# Altium project Ultrascale.PrjPcb (part 6 of 9)

## Sheet PMOD_ARD_RASP.SchDoc
size A3
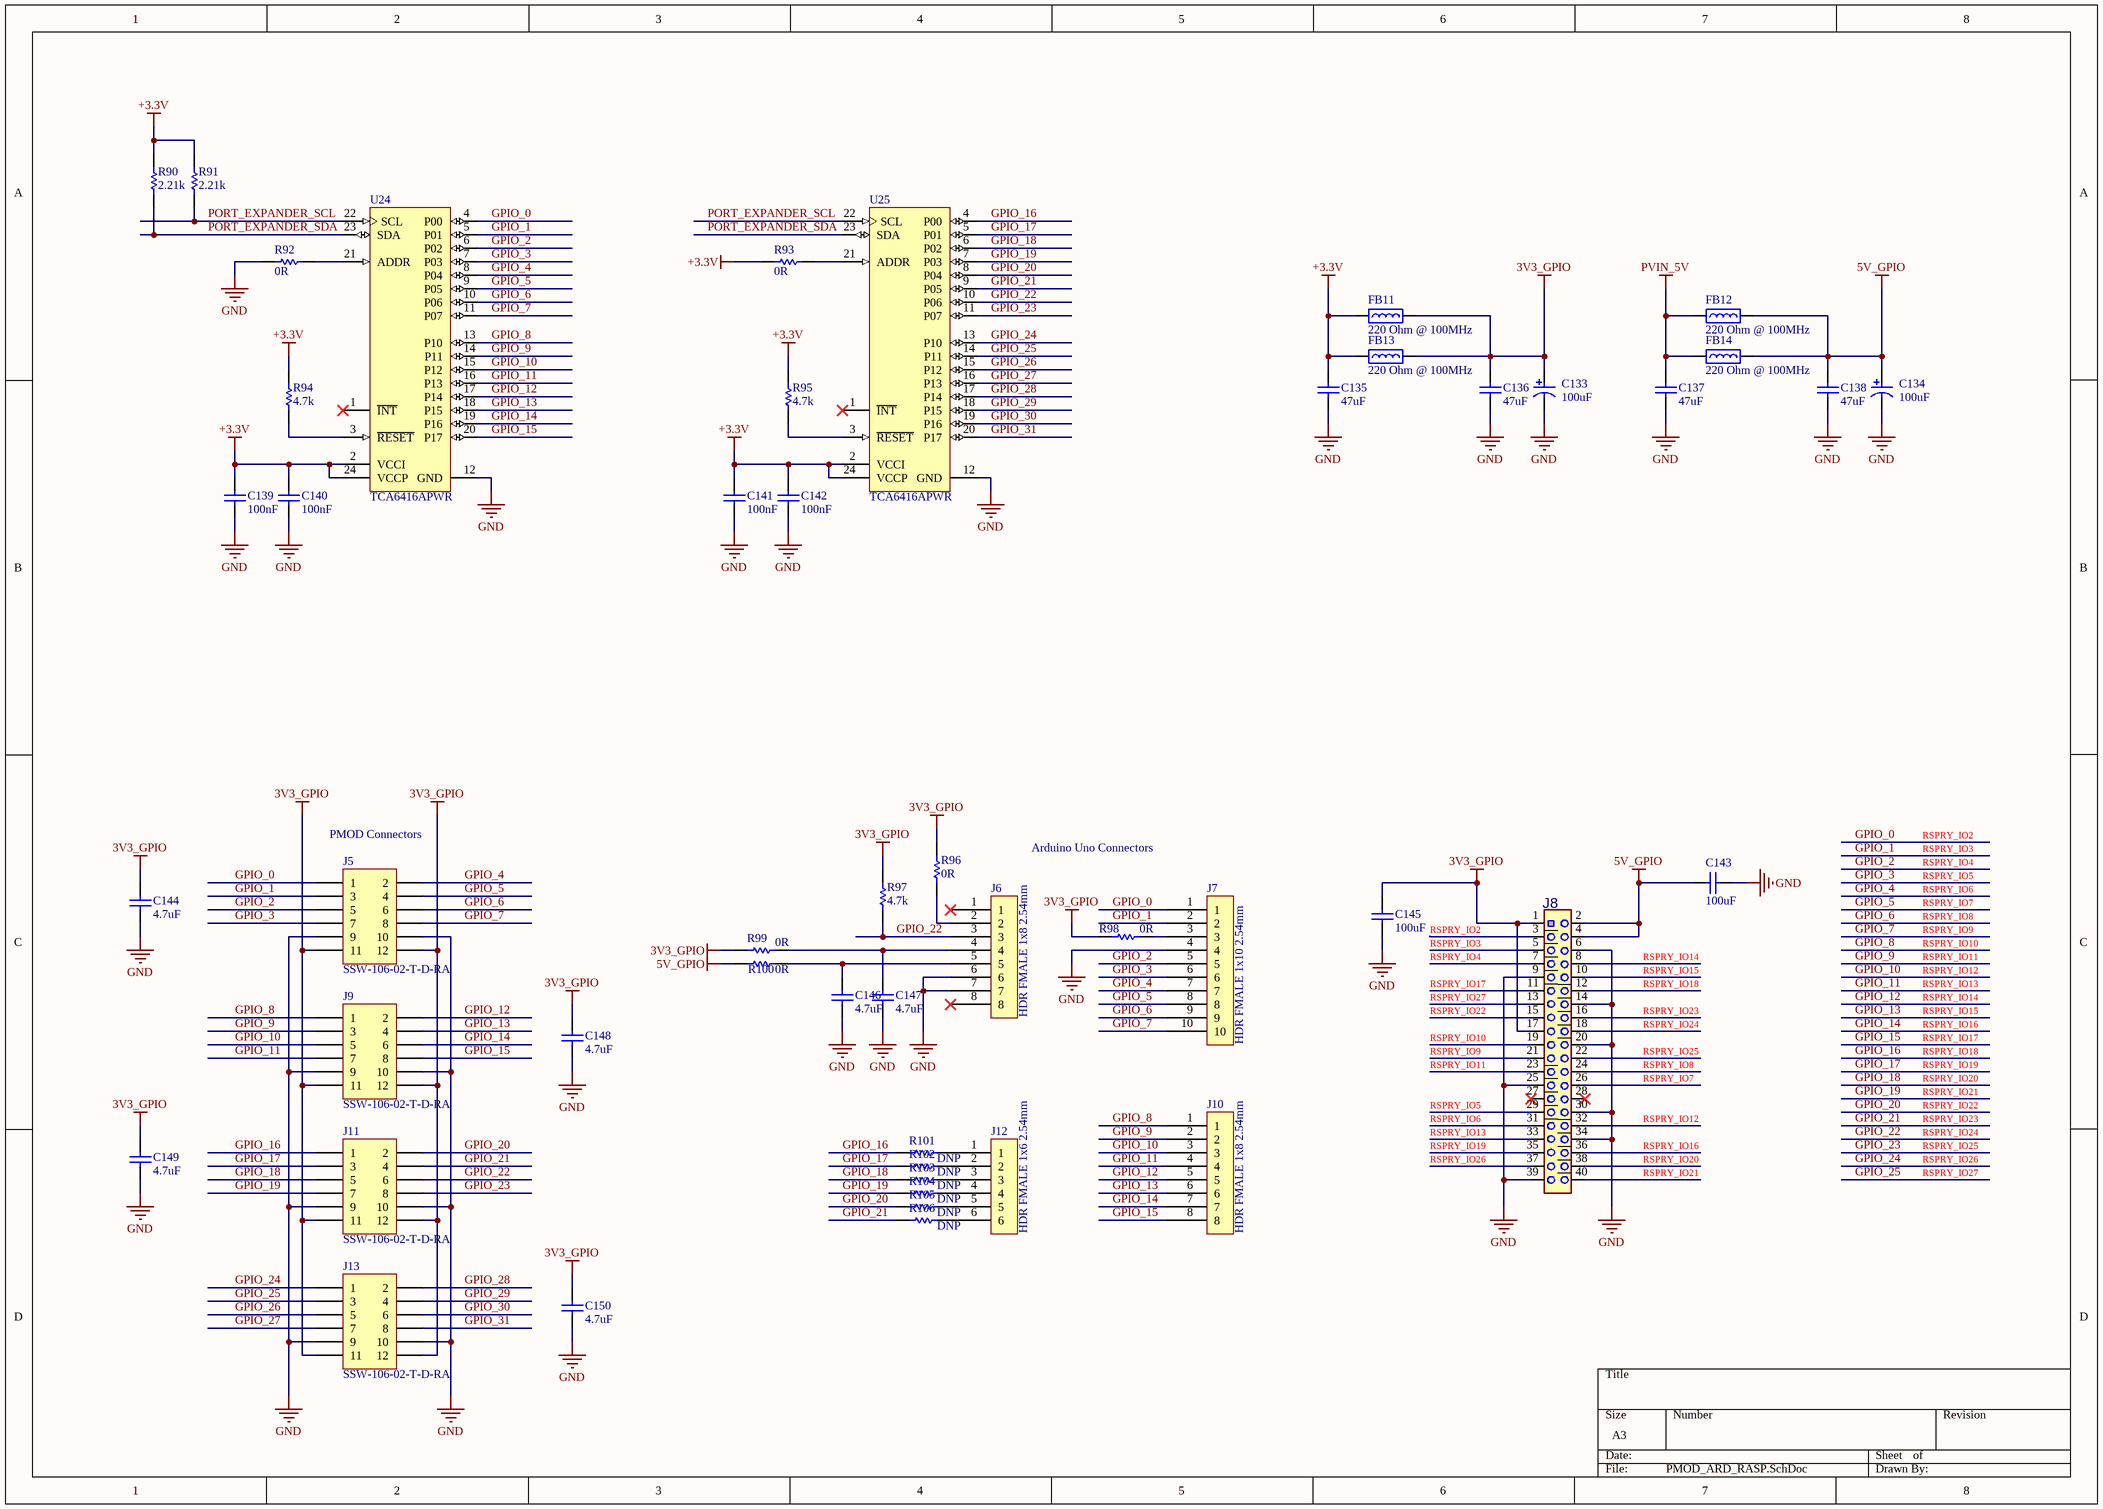
[diagram p18: PMOD_ARD_RASP.SchDoc]

### Parts
C133  100uF  [AVX_TAN_F95_P_0905]
C134  100uF  [AVX_TAN_F95_P_0905]
C135  47uF  [CAPC3216L_1206]
C136  47uF  [CAPC3216L_1206]
C137  47uF  [CAPC3216L_1206]
C138  47uF  [CAPC3216L_1206]
C139  100nF  [CAPC1005L_0402]
C140  100nF  [CAPC1005L_0402]
C141  100nF  [CAPC1005L_0402]
C142  100nF  [CAPC1005L_0402]
C143  100uF  [CAPC3225N_1210]
C144  4.7uF  [CAPC1005L_0402]
C145  100uF  [CAPC3225N_1210]
C146  4.7uF  [CAPC1005L_0402]
C147  4.7uF  [CAPC1005L_0402]
C148  4.7uF  [CAPC1005L_0402]
C149  4.7uF  [CAPC1005L_0402]
C150  4.7uF  [CAPC1005L_0402]
FB11  Impedance @ Frequency: 220 Ohm @ 100MHz  [INDC1608N_0603]  (hidden comment: BEAD0603_220_2A5_40M)
FB12  Impedance @ Frequency: 220 Ohm @ 100MHz  [INDC1608N_0603]  (hidden comment: BEAD0603_220_2A5_40M)
FB13  Impedance @ Frequency: 220 Ohm @ 100MHz  [INDC1608N_0603]  (hidden comment: BEAD0603_220_2A5_40M)
FB14  Impedance @ Frequency: 220 Ohm @ 100MHz  [INDC1608N_0603]  (hidden comment: BEAD0603_220_2A5_40M)
J5  SSW-106-02-T-D-RA  [HDR2X6H]
J6  HDR FMALE 1x8 2.54mm  [Hdr_Female_1x8_2.54mm]
J7  HDR FMALE 1x10 2.54mm  [Hdr_Female_1x10_2.54mm]
J8  Header 2x20  [HDR_M_2.54_2x20]  (value not drawn)
J9  SSW-106-02-T-D-RA  [HDR2X6H]
J10  HDR FMALE 1x8 2.54mm  [Hdr_Female_1x8_2.54mm]
J11  SSW-106-02-T-D-RA  [HDR2X6H]
J12  HDR FMALE 1x6 2.54mm  [Hdr_Female_1x6_2.54mm]
J13  SSW-106-02-T-D-RA  [HDR2X6H]
R90  value 2.21k  [RESC1005L_0402]  (hidden comment: RES0402_2K21_0W1_1T)
R91  value 2.21k  [RESC1005L_0402]  (hidden comment: RES0402_2K21_0W1_1T)
R92  value 0R  [RESC1005L_0402]  (hidden comment: RES0402_0R_0W1)
R93  value 0R  [RESC1005L_0402]  (hidden comment: RES0402_0R_0W1)
R94  value 4.7k  [RESC1005L_0402]  (hidden comment: RES0402_4K7_0W1_1T)
R95  value 4.7k  [RESC1005L_0402]  (hidden comment: RES0402_4K7_0W1_1T)
R96  value 0R  [RESC1005L_0402]  (hidden comment: RES0402_0R)
R97  value 4.7k  [RESC1005L_0402]  (hidden comment: RES0402_4K7_0W1_1T)
R98  value 0R  [RESC1005L_0402]  (hidden comment: RES0402_0R)
R99  value 0R  [RESC1005L_0402]  (hidden comment: RES0402_0R)
R100  value 0R  [RESC1005L_0402]  (hidden comment: RES0402_0R)
R101  value DNP  [RESC1005L_0402]  (hidden comment: RES0402)
R102  value DNP  [RESC1005L_0402]  (hidden comment: RES0402)
R103  value DNP  [RESC1005L_0402]  (hidden comment: RES0402)
R104  value DNP  [RESC1005L_0402]  (hidden comment: RES0402)
R105  value DNP  [RESC1005L_0402]  (hidden comment: RES0402)
R106  value DNP  [RESC1005L_0402]  (hidden comment: RES0402)
U24  TCA6416APWR  [PW24_L]
U25  TCA6416APWR  [PW24_L]

### Nets
3V3_GPIO: C133.1 C136.2 C144.2 C145.2 C148.2 C149.2 C150.2 FB11.2 FB13.2 J5.11 J5.12 J8.1(P1) J8.17(P17) J9.11 J9.12 J11.11 J11.12 J13.11 J13.12 R96.1 R97.2 R98.2 R99.2
5V_GPIO: C134.1 C138.2 C143.2 FB12.2 FB14.2 J8.2(P2) J8.4(P4) R100.2
+3.3V: C135.2 C139.2 C140.2 C141.2 C142.2 FB11.1 FB13.1 R90.2 R91.2 R93.1 R94.2 R95.2 U24.2(VCCI) U24.24(VCCP) U25.2(VCCI) U25.24(VCCP)
GND: C133.2 C134.2 C135.1 C136.1 C137.1 C138.1 C139.1 C140.1 C141.1 C142.1 C143.1 C144.1 C145.1 C146.1 C147.1 C148.1 C149.1 C150.1 J5.9 J5.10 J6.6 J6.7 J7.4 J8.6(P6) J8.9(P9) J8.14(P14) J8.20(P20) J8.25(P25) J8.30(P30) J8.34(P34) J8.39(P39) J9.9 J9.10 J11.9 J11.10 J13.9 J13.10 R92.1 U24.12(GND) U25.12(GND)
PVIN_5V: C137.2 FB12.1 FB14.1
GPIO_0: J5.1 J7.1 J8.3(P3) U24.4(P00)  [also labelled RSPRY_IO2]
GPIO_1: J5.3 J7.2 J8.5(P5) U24.5(P01)  [also labelled RSPRY_IO3]
GPIO_2: J5.5 J7.5 J8.7(P7) U24.6(P02)  [also labelled RSPRY_IO4]
GPIO_3: J5.7 J7.6 J8.29(P29) U24.7(P03)  [also labelled RSPRY_IO5]
GPIO_4: J5.2 J7.7 J8.31(P31) U24.8(P04)  [also labelled RSPRY_IO6]
GPIO_5: J5.4 J7.8 J8.26(P26) U24.9(P05)  [also labelled RSPRY_IO7]
GPIO_6: J5.6 J7.9 J8.24(P24) U24.10(P06)  [also labelled RSPRY_IO8]
GPIO_7: J5.8 J7.10 J8.21(P21) U24.11(P07)  [also labelled RSPRY_IO9]
GPIO_8: J8.19(P19) J9.1 J10.1 U24.13(P10)  [also labelled RSPRY_IO10]
GPIO_9: J8.23(P23) J9.3 J10.2 U24.14(P11)  [also labelled RSPRY_IO11]
GPIO_10: J8.32(P32) J9.5 J10.3 U24.15(P12)  [also labelled RSPRY_IO12]
GPIO_11: J8.33(P33) J9.7 J10.4 U24.16(P13)  [also labelled RSPRY_IO13]
GPIO_12: J8.8(P8) J9.2 J10.5 U24.17(P14)  [also labelled RSPRY_IO14]
GPIO_13: J8.10(P10) J9.4 J10.6 U24.18(P15)  [also labelled RSPRY_IO15]
GPIO_14: J8.36(P36) J9.6 J10.7 U24.19(P16)  [also labelled RSPRY_IO16]
GPIO_15: J8.11(P11) J9.8 J10.8 U24.20(P17)  [also labelled RSPRY_IO17]
GPIO_16: J8.12(P12) J11.1 R101.1 U25.4(P00)  [also labelled RSPRY_IO18]
GPIO_17: J8.35(P35) J11.3 R102.1 U25.5(P01)  [also labelled RSPRY_IO19]
GPIO_18: J8.38(P38) J11.5 R103.1 U25.6(P02)  [also labelled RSPRY_IO20]
GPIO_19: J8.40(P40) J11.7 R104.1 U25.7(P03)  [also labelled RSPRY_IO21]
GPIO_20: J8.15(P15) J11.2 R105.1 U25.8(P04)  [also labelled RSPRY_IO22]
GPIO_21: J8.16(P16) J11.4 R106.1 U25.9(P05)  [also labelled RSPRY_IO23]
GPIO_22: J6.3 J8.18(P18) J11.6 R97.1 U25.10(P06)  [also labelled RSPRY_IO24]
GPIO_23: J8.22(P22) J11.8 U25.11(P07)  [also labelled RSPRY_IO25]
GPIO_24: J8.37(P37) J13.1 U25.13(P10)  [also labelled RSPRY_IO26]
GPIO_25: J8.13(P13) J13.3 U25.14(P11)  [also labelled RSPRY_IO27]
GPIO_26: J13.5 U25.15(P12)
GPIO_27: J13.7 U25.16(P13)
GPIO_28: J13.2 U25.17(P14)
GPIO_29: J13.4 U25.18(P15)
GPIO_30: J13.6 U25.19(P16)
GPIO_31: J13.8 U25.20(P17)
PORT_EXPANDER_SCL: R91.1 U24.22(SCL) U25.22(SCL)
PORT_EXPANDER_SDA: R90.1 U24.23(SDA) U25.23(SDA)
NetC146_2: C146.2 J6.5 R100.1
NetC147_2: C147.2 J6.4 R99.1
NetJ6_2: J6.2 R96.2
NetJ7_3: J7.3 R98.1
NetJ12_1: J12.1 R101.2
NetJ12_2: J12.2 R102.2
NetJ12_3: J12.3 R103.2
NetJ12_4: J12.4 R104.2
NetJ12_5: J12.5 R105.2
NetJ12_6: J12.6 R106.2
NetR92_2: R92.2 U24.21(ADDR)
NetR93_2: R93.2 U25.21(ADDR)
NetR94_1: R94.1 U24.3(~{RESET})
NetR95_1: R95.1 U25.3(~{RESET})

Not connected (* = marked no-connect by the designer): J6 1* 8*; J8 27(P27)* 28(P28)*; U24 1(~{INT})*; U25 1(~{INT})*

### Notes on the sheet
- (near J5) PMOD Connectors
- Arduino Uno Connectors

### Library data of the parts
C133 C134 = CAPELE0905TAN100U6V3_20T: as C123 on sheet USB3.0_UART; Package: 0905 P; ComponentLink1Description: Datasheet; ComponentLink1URL: C:\Users\Public\Documents\Altium\AD16\Library\PDF\F95.pdf; Value: 100uF; Voltage: 6.3V; Tolerance: 20%; Supplier 1: Digi-Key; Supplier Part Number 1: 478-8393-1-ND; Operating Temperature: -55°C ~ 125°C
C135-C138 = CAPCER1206X5R47U25V_20T: CAP CER 47UF 25V X5R 1206; Manufacturer 1: TDK Corporation; Manufacturer Part Number 1: C3216X5R1E476M160AC; Tolerance: 20%; Package: 1206; ComponentLink1Description: Datasheet; Value: 47uF; Voltage: 25V; Temperature Coefficient: X5R; Supplier 1: Digi-Key; Supplier Part Number 1: 445-8047-1-ND; Operating Temperature: -55°C ~ 85°C
C139-C142 = CAPCER0402X7R100N25V_10T: as C426-C429 on sheet PS_GTR; Package: 0402; ComponentLink1Description: Datasheet; Value: 100nF; Voltage: 25V; Temperature Coefficient: X7R; Supplier 1: Digi-Key; Supplier Part Number 1: 490-10698-1-ND; Operating Temperature: -55°C ~ 125°C
C143 C145 = CAPCER1210X5R100U16V_20T: CAP CER 100UF 16V X5R 1210; Manufacturer 1: Taiyo Yuden; Manufacturer Part Number 1: EMK325ABJ107MM-T; Tolerance: 20%; Package: 1210; ComponentLink1Description: Datasheet; Value: 100uF; Voltage: 16V; Temperature Coefficient: X5R; Supplier 1: Digi-Key; Supplier Part Number 1: 587-3152-1-ND; Operating Temperature: -55°C ~ 85°C
C144 C146-C150 = CAPCER0402X5R4U710V_10T: as C127 on sheet USB3.0_UART; Package: 0402; ComponentLink1Description: Datasheet; Value: 4.7uF; Voltage: 10V; Temperature Coefficient: x5R; Supplier 1: Digi-Key; Supplier Part Number 1: 445-13820-1-ND; Operating Temperature: -55°C ~ 85°C
FB11-FB14 = BEAD0603_220_2A5_40M: as FB42 on sheet PS_GTR; Package: 0603; ComponentLink1Description: Datasheet; ComponentLink1URL: C:\Users\Public\Documents\Altium\AD16\Library\PDF\ENFA0003.pdf; Supplier 1: Digi-Key; Supplier Part Number 1: 490-5225-1-ND; Operating Temperature: -55°C ~ 125°C
J5 J9 J11 J13 = SSW-106-02-T-D-RA: CONN RCPT .100" 12PS DL R/A TIN; Manufacturer 1: Samtec Inc.; ComponentLink1Description: Datasheet; ComponentLink1URL: C:\Users\Public\Documents\Altium\AD16\Library\PDF\ssw-1xx-xx-xxx-x-xx-xxx-xx-mkt.pdf; Supplier 1: Digi-Key; Supplier Part Number 1: SAM10026-ND; Manufacturer Part Number 1: SSW-106-02-T-D-RA; Operating Temperature: -55°C ~ 105°C; Insulation Height: 0.195" (4.95mm)
J6 J10 = M20-7820842: 08-WAY SIL VERT SOCKET L/FREE; Manufacturer 1: Harwin Inc; Connector Type: Receptacle; Number of Positions: 8; Number of Positions Loaded: All; Pitch: 0.100" (2.54mm); .Creator: MM; .Checked PCB: RF; Supplier 1: Digi-Key; Manufacturer Part Number 1: M20-7820842; RoHS: RoHS Compliant; Category: Connectors, Interconnects; Stock 1: 2070; Pricing 1: 1=1.1, 29=0.91207, 58=0.87397, 116=0.83603, 261=0.76, 522=0.684, 1015=0.608, 2523=0.551 (USD); Packaging: Tube; Contact Type: Female Socket; Number of Rows: 1; Row Spacing: -; Mounting Type: Through Hole; Termination: Solder; Fastening Type: -; Features: -; Contact Finish: Gold; Contact Finish Thickness: Flash; Color: Black; ComponentLink1URL: http://harwin.com/includes/pdfs/M20-782.pdf; ComponentLink1Description: http://harwin.com/includes/pdfs/M20-782.pdf; Supplier Part Number 1: 952-1823-ND; .Checked SCH: RF
J7 = M20-7821046: 10-WAY SIL VERT SOCKET L/FREE; Manufacturer 1: Harwin Inc; Connector Type: Receptacle; Number of Positions: 10; Number of Positions Loaded: All; Pitch: 0.100" (2.54mm); .Creator: MM; .Checked PCB: RF; Supplier 1: Digi-Key; Manufacturer Part Number 1: M20-7821046; RoHS: RoHS Compliant; Category: Connectors, Interconnects; Stock 1: 214; Pricing 1: 1=1.28, 23=1.12217, 46=1.05609, 69=1.01203, 115=0.968, 253=0.88, 506=0.792, 1012=0.704, 2507=0.638 (USD); Packaging: Tube; Contact Type: Female Socket; Number of Rows: 1; Row Spacing: -; Mounting Type: Through Hole; Termination: Solder; Fastening Type: -; Features: -; Contact Finish: Tin; Contact Finish Thickness: -; Color: Black; ComponentLink1URL: http://harwin.com/includes/pdfs/M20-782.pdf; ComponentLink1Description: http://harwin.com/includes/pdfs/M20-782.pdf; Supplier Part Number 1: 952-1847-ND; .Checked SCH: RF
J8 = Header 2x20: CONN HEADER 40POS .100" SGL GOLD
J12 = M20-7820646: 06-WAY SIL VERT SOCKET L/FREE; Manufacturer 1: Harwin Inc; Connector Type: Receptacle; Number of Positions: 6; Number of Positions Loaded: All; Pitch: 0.100" (2.54mm); .Checked PCB: MM; Supplier 1: Digi-Key; Manufacturer Part Number 1: M20-7820646; RoHS: RoHS Compliant; Category: Connectors, Interconnects; Stock 1: 87; Pricing 1: 1=0.96, 38=0.79211, 76=0.75895, 114=0.72596, 266=0.66, 532=0.594, 1026=0.528, 2508=0.4785 (USD); Packaging: Tube; Contact Type: Female Socket; Number of Rows: 1; Row Spacing: -; Mounting Type: Through Hole; Termination: Solder; Fastening Type: -; Features: -; Contact Finish: Tin; Contact Finish Thickness: -; Color: Black; ComponentLink1URL: http://harwin.com/includes/pdfs/M20-782.pdf; ComponentLink1Description: http://harwin.com/includes/pdfs/M20-782.pdf; Supplier Part Number 1: 952-1809-ND; .Checked SCH: MM; .Creator: MM
R90 R91 = RES0402_2K21_0W1_1T: RES SMD 2.21K OHM 1% 1/10W 0402; Manufacturer 1: Panasonic Electronic Components; Manufacturer Part Number 1: ERJ-2RKF2211X; Package: 0402; ComponentLink1Description: Datasheet; Power: 1/10W; Tolerance: 1%; Supplier 1: Digi-Key; Supplier Part Number 1: P2.21KLCT-ND
R92 R93 = RES0402_0R_0W1: as R305 on sheet PS_GTR; Package: 0402; ComponentLink1Description: Datasheet; Power: 1/10W; Tolerance: -; Supplier 1: Digi-Key; Supplier Part Number 1: P0.0JCT-ND
R94 R95 R97 = RES0402_4K7_0W1_1T: as R80 on sheet USB3.0_UART; Package: 0402; ComponentLink1Description: Datasheet; Power: 1/10W; Tolerance: 1%; Supplier 1: Digi-Key; Supplier Part Number 1: P4.70KLCT-ND
R96 R98-R100 = RES0402_0R: as R198 on sheet DisplayPort; Package: 0402; ComponentLink1Description: Datasheet; Tolerance: -; Supplier 1: Digi-Key; Supplier Part Number 1: 541-0.0JCT-ND
R101-R106 = RES0402: RES SMD 0402 Footprint; Package: 0402; ComponentLink1Description: Datasheet; Tolerance: -
U24 U25 = TCA6416APWR: Low-Voltage 16-Bit I2C and SMBus I/O Expander, 16 Outputs, 1.65 to 5.5 V, -40 to 85 degC, 24-pin TSSOP (PW), Green (RoHS & no Sb/Br); Manufacturer: Texas Instruments; SubFamily: I2C IO Expander; No. of Outputs: 16; Interrupt Output: Yes; fSCLK(Max)(MHz): 400; VCC(Min)(V): 1.65; VCC(Max)(V): 5.5; I2C Address: 0100 00x; DatasheetVersion: SCPS194A; PackageVersion: revG, Feb-2011; PackageReference: PW24; PackageDescription: 24-Pin Thin Small Outline Package 0.65 mm Pitch; Supplier 1: Arrow; Supplier Part Number 1: 47581856S8237284N7713; Supplier 2: Digi-Key; Supplier Part Number 2: 296-24536-2-ND; Supplier 3: Digi-Key; Supplier Part Number 3: 296-24536-1-ND; Supplier 4: Digi-Key; Supplier Part Number 4: 296-24536-6-ND; Supplier 5: Farnell; Supplier Part Number 5: 2101304; Supplier 6: Newark; Supplier Part Number 6: 10R6151; Supplier 7: Mouser; Supplier Part Number 7: 595-TCA6416APWR; Eco-Plan: Green (RoHS & no Sb/Br); Reset Input: Yes; Max Frequency(kHz): 400; # of I/Os: 16; Vcc range(V): 1.65 to 5.5; Low Power: Yes; Configuration Registers: Yes; 5V Tolerant I/O: Yes; Push-Pull I/O Type: Yes; Mounting Technology: Surface Mount; PartNumber: TCA6416APWR; Code_JEDEC: MO-153; ComponentLink1Description: Datasheet; ComponentLink1URL: http://www.ti.com/general/docs/lit/getliterature.tsp?genericPartNumber=TCA6416A&fileType=pdf; ComponentLink2Description: Package Specification; ComponentLink2URL: http://www.ti.com/litv/pdf/mpds177g

## Sheet eMMC_TPM.SchDoc
size A3
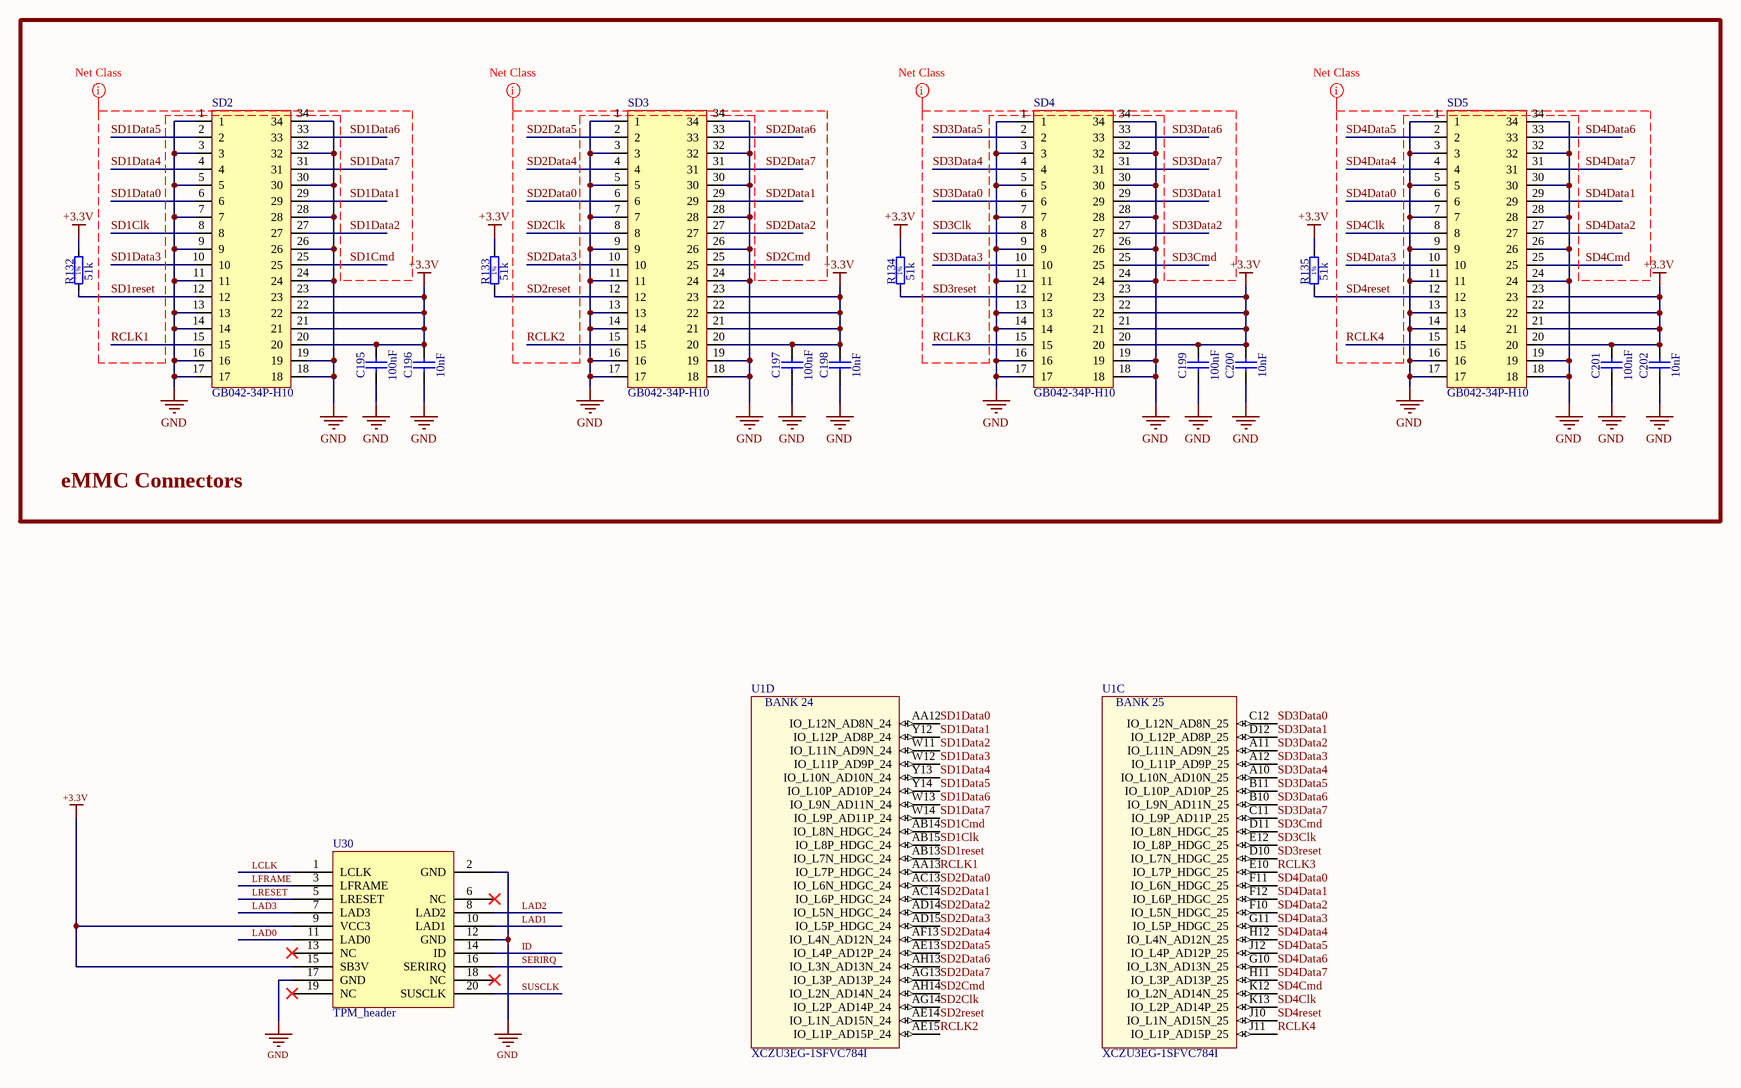
[diagram p19: eMMC_TPM.SchDoc]

### Parts
C195  100nF  [CAPC1608X87N]
C196  10nF  [CAPC1608X87N]
C197  100nF  [CAPC1608X87N]
C198  10nF  [CAPC1608X87N]
C199  100nF  [CAPC1608X87N]
C200  10nF  [CAPC1608X87N]
C201  100nF  [CAPC1608X87N]
C202  10nF  [CAPC1608X87N]
R132  51k  [RESC1608X55N]
R133  51k  [RESC1608X55N]
R134  51k  [RESC1608X55N]
R135  51k  [RESC1608X55N]
SD2  GB042-34P-H10  [GB042-34P-H10]
SD3  GB042-34P-H10  [GB042-34P-H10]
SD4  GB042-34P-H10  [GB042-34P-H10]
SD5  GB042-34P-H10  [GB042-34P-H10]
U1  XCZU3EG-1SFVC784I  [BGA784x28]  (parts C,D of 22)
U30  TPM_header  [PIN HEADER 20POS]

### Blocks framed on the sheet
eMMC Connectors: C195-C202 R132-R135 SD2-SD5

### Nets
+3.3V: C195.2 C196.2 C197.2 C198.2 C199.2 C200.2 C201.2 C202.2 R132.2 R133.2 R134.2 R135.2 SD2.20 SD2.21 SD2.22 SD2.23 SD3.20 SD3.21 SD3.22 SD3.23 SD4.20 SD4.21 SD4.22 SD4.23 SD5.20 SD5.21 SD5.22 SD5.23 U30.9(VCC3) U30.15(SB3V)
GND: C195.1 C196.1 C197.1 C198.1 C199.1 C200.1 C201.1 C202.1 SD2.1 SD2.3 SD2.5 SD2.7 SD2.9 SD2.11 SD2.13 SD2.14 SD2.16 SD2.17 SD2.18 SD2.19 SD2.24 SD2.26 SD2.28 SD2.30 SD2.32 SD2.34 SD3.1 SD3.3 SD3.5 SD3.7 SD3.9 SD3.11 SD3.13 SD3.14 SD3.16 SD3.17 SD3.18 SD3.19 SD3.24 SD3.26 SD3.28 SD3.30 SD3.32 SD3.34 SD4.1 SD4.3 SD4.5 SD4.7 SD4.9 SD4.11 SD4.13 SD4.14 SD4.16 SD4.17 SD4.18 SD4.19 SD4.24 SD4.26 SD4.28 SD4.30 SD4.32 SD4.34 SD5.1 SD5.3 SD5.5 SD5.7 SD5.9 SD5.11 SD5.13 SD5.14 SD5.16 SD5.17 SD5.18 SD5.19 SD5.24 SD5.26 SD5.28 SD5.30 SD5.32 SD5.34 U30.2(GND) U30.12(GND) U30.17(GND)
ID: U30.14(ID)
LAD0: U30.11(LAD0)
LAD1: U30.10(LAD1)
LAD2: U30.8(LAD2)
LAD3: U30.7(LAD3)
LCLK: U30.1(LCLK)
LFRAME: U30.3(LFRAME)
LRESET: U30.5(LRESET)
RCLK1: SD2.15 U1.AA13(IO_L7P_HDGC_24)
RCLK2: SD3.15 U1.AE15(IO_L1P_AD15P_24)
RCLK3: SD4.15 U1.E10(IO_L7P_HDGC_25)
RCLK4: SD5.15 U1.J11(IO_L1P_AD15P_25)
SD1Clk: SD2.8 U1.AB15(IO_L8P_HDGC_24)
SD1Cmd: SD2.25 U1.AB14(IO_L8N_HDGC_24)
SD1Data0: SD2.6 U1.AA12(IO_L12N_AD8N_24)
SD1Data1: SD2.29 U1.Y12(IO_L12P_AD8P_24)
SD1Data2: SD2.27 U1.W11(IO_L11N_AD9N_24)
SD1Data3: SD2.10 U1.W12(IO_L11P_AD9P_24)
SD1Data4: SD2.4 U1.Y13(IO_L10N_AD10N_24)
SD1Data5: SD2.2 U1.Y14(IO_L10P_AD10P_24)
SD1Data6: SD2.33 U1.W13(IO_L9N_AD11N_24)
SD1Data7: SD2.31 U1.W14(IO_L9P_AD11P_24)
SD1reset: R132.1 SD2.12 U1.AB13(IO_L7N_HDGC_24)
SD2Clk: SD3.8 U1.AG14(IO_L2P_AD14P_24)
SD2Cmd: SD3.25 U1.AH14(IO_L2N_AD14N_24)
SD2Data0: SD3.6 U1.AC13(IO_L6N_HDGC_24)
SD2Data1: SD3.29 U1.AC14(IO_L6P_HDGC_24)
SD2Data2: SD3.27 U1.AD14(IO_L5N_HDGC_24)
SD2Data3: SD3.10 U1.AD15(IO_L5P_HDGC_24)
SD2Data4: SD3.4 U1.AF13(IO_L4N_AD12N_24)
SD2Data5: SD3.2 U1.AE13(IO_L4P_AD12P_24)
SD2Data6: SD3.33 U1.AH13(IO_L3N_AD13N_24)
SD2Data7: SD3.31 U1.AG13(IO_L3P_AD13P_24)
SD2reset: R133.1 SD3.12 U1.AE14(IO_L1N_AD15N_24)
SD3Clk: SD4.8 U1.E12(IO_L8P_HDGC_25)
SD3Cmd: SD4.25 U1.D11(IO_L8N_HDGC_25)
SD3Data0: SD4.6 U1.C12(IO_L12N_AD8N_25)
SD3Data1: SD4.29 U1.D12(IO_L12P_AD8P_25)
SD3Data2: SD4.27 U1.A11(IO_L11N_AD9N_25)
SD3Data3: SD4.10 U1.A12(IO_L11P_AD9P_25)
SD3Data4: SD4.4 U1.A10(IO_L10N_AD10N_25)
SD3Data5: SD4.2 U1.B11(IO_L10P_AD10P_25)
SD3Data6: SD4.33 U1.B10(IO_L9N_AD11N_25)
SD3Data7: SD4.31 U1.C11(IO_L9P_AD11P_25)
SD3reset: R134.1 SD4.12 U1.D10(IO_L7N_HDGC_25)
SD4Clk: SD5.8 U1.K13(IO_L2P_AD14P_25)
SD4Cmd: SD5.25 U1.K12(IO_L2N_AD14N_25)
SD4Data0: SD5.6 U1.F11(IO_L6N_HDGC_25)
SD4Data1: SD5.29 U1.F12(IO_L6P_HDGC_25)
SD4Data2: SD5.27 U1.F10(IO_L5N_HDGC_25)
SD4Data3: SD5.10 U1.G11(IO_L5P_HDGC_25)
SD4Data4: SD5.4 U1.H12(IO_L4N_AD12N_25)
SD4Data5: SD5.2 U1.J12(IO_L4P_AD12P_25)
SD4Data6: SD5.33 U1.G10(IO_L3N_AD13N_25)
SD4Data7: SD5.31 U1.H11(IO_L3P_AD13P_25)
SD4reset: R135.1 SD5.12 U1.J10(IO_L1N_AD15N_25)
SERIRQ: U30.16(SERIRQ)
SUSCLK: U30.20(SUSCLK)

Not connected (* = marked no-connect by the designer): U30 6(NC)* 13(NC)* 18(NC)* 19(NC)*

### Layout directives
net class SD1: RCLK1, SD1Clk, SD1Cmd, SD1Data0, SD1Data1, SD1Data2, SD1Data3, SD1Data4, SD1Data5, SD1Data6, SD1Data7, SD1reset
net class SD2: RCLK2, SD2Clk, SD2Cmd, SD2Data0, SD2Data1, SD2Data2, SD2Data3, SD2Data4, SD2Data5, SD2Data6, SD2Data7, SD2reset
net class SD3: RCLK3, SD3Clk, SD3Cmd, SD3Data0, SD3Data1, SD3Data2, SD3Data3, SD3Data4, SD3Data5, SD3Data6, SD3Data7, SD3reset
net class SD4: RCLK4, SD4Clk, SD4Cmd, SD4Data0, SD4Data1, SD4Data2, SD4Data3, SD4Data4, SD4Data5, SD4Data6, SD4Data7, SD4reset

### Notes on the sheet
- (in symbol R0603_51K_1%_0.1W_100PPM) 1%
- (in symbol XCZU3EG-1SFVC784I, part C) BANK 25
- (in symbol XCZU3EG-1SFVC784I, part D) BANK 24

### Library data of the parts
C195 C197 C199 C201 = CC0603_100NF_50V_10%_X7R: Non-polarised capacitor; Part Description: SMD Multilayer Chip Ceramic Capacitor; Manufacturer: MULTICOMP; Manufacturer Part Number: MCB0603R104KCT; Manufacturer1 Part Number: 223858615649; Voltage: 50V; TC: X7R; Tolerance: ±10%; Table: Capacitors SMD; Voltage Rating: 16; Capacitance: 0.1; SVHC: No SVHC (17-Dec-2015); Ceramic Capacitor Case: 0603 [1608 Metric]; Dielectric Characteristic: X7; Product Range: MCB Series; Capacitance Tolerance: ± 10%; Capacitor Terminals: SMD; Part Number: CC0603_100NF_50V_10%_X7R; Component Kind: Standard; Component Type: Standard; Pin Count: 2; Value: 100nF; Status: Preferred; Case: 0603; Mounted: Yes; Socket: No; SMD: Yes; Manufacturer1 Example: PHYCOMP; Manufacturer1 ComponentHeight: 0.87mm; HelpURL: \\cern.ch\dfs\Applications\Altium\Datasheets\CC0603_X7R_PHYCOMP.pdf; Author: CERN DEM JLC; CreateDate: 3.12.2007; LatestRevisionDate: 3.12.2007; RoHS: YES; Packaging: Cut Tape; Operating Temperature Min: -55; MSL: -; Supplier Part Number: 9406140; Operating Temperature Range: -55°C to +125°C<!--FANDB--><div class="features-and-benefits-container"><div class="features-and-benefits-description"><span class="features-benefits-value">The MCB0603R104KCT is a multilayer Ceramic Capacitor with 0603 chip, for general digital circuit. Consists of a conducting material and electrodes. To manufacture a chip-type SMT and achieve miniaturization, high density and high efficiency, ceramic condensers are used. MLCC is made by X7; Supplier: Farnell; Capacitance Tolerance ±: ± 10%; Operating Temperature Max: 125
C196 C198 C200 C202 = CC0603_10NF_50V_10%_X7R: Non-polarised capacitor; Part Description: SMD Multilayer Chip Ceramic Capacitor; Manufacturer: MULTICOMP; Manufacturer Part Number: MC0603B103K500CT; Manufacturer1 Part Number: 223858615636; Voltage: 50V; TC: X7R; Tolerance: ±10%; Table: Capacitors SMD; Voltage Rating: 50; Product Range: MC Series; No. of Pins: 2; Capacitor Terminals: SMD; Ceramic Capacitor Case: 0603 [1608 Metric]; SVHC: No SVHC (17-Dec-2015); Capacitance Tolerance ±: ± 10%; External Length / Height: 0.8; Dielectric Characteristic: X7; External Depth: 1.6; Capacitance: 0.01; Part Number: CC0603_10NF_50V_10%_X7R; Component Kind: Standard; Component Type: Standard; Pin Count: 2; Value: 10nF; Status: Preferred; Case: 0603; Mounted: Yes; Socket: No; SMD: Yes; Manufacturer1 Example: PHYCOMP; Manufacturer1 ComponentHeight: 0.87mm; HelpURL: \\cern.ch\dfs\Applications\Altium\Datasheets\CC0603_X7R_PHYCOMP.pdf; Author: CERN DEM JLC; CreateDate: 3.12.2007; LatestRevisionDate: 3.12.2007; Operating Temperature Range: -55°C to +125°C<!--FANDB--><div class="features-and-benefits-container"><div class="features-and-benefits-description"><span class="features-benefits-value">The Multicomp MC series is general purpose MLCC capacitors with X7R dielectric material which provides high electrical precision, stability and reliability. This MLCC capacitor consists of a conducting material and electrodes with high density and high efficiency ceramic condensers.</span></div><div class="features-and-benefits-list"><ul class="features-and-benefits-list-list"><li class="features-and-benefits-list-item">Small size with higher capacitance values</li><li class="features-and-benefits-list-item">0201, 0402, 0603, 0805, 1206, 1210, 1812 case sizes available</li><li class="features-and-benefits-list-item">Capacitance value ranging from 100pF to 47?F</li><li class="features-and-benefits-list-item">Capacitor with lead free termination (pure Tin)</li><li class="features-and-benefits-list-item">High electrical precision, stability and reliability</li><li class="features-and-benefits-list-item">Rated voltage of 6.3V, 10V, 16V, 25V, 50V, 100V</li><li class="features-and-benefits-list-item">Operating temperature of -55°C to +125°C</li><li class="features-and-benefits-list-item">Available in ±5%, ±10% and ±20; MSL: -; Supplier: Farnell; Capacitance Tolerance: ± 10%; External Width: 0.8; Supplier Part Number: 1759102; Packaging: Cut Tape; Operating Temperature Max: 125; Operating Temperature Min: -55; RoHS: YES
R132-R135 = R0603_51K_1%_0.1W_100PPM: Resistor - 1%; Part Description: General Purpose Thick Film Chip Resistor; Manufacturer: Yageo; Manufacturer Part Number: RC0603JR-0751KL; Manufacturer1 Part Number: NRC06F5102TRF; Power: 0.1W; TC: ±100ppm/°C; Tolerance: ±5%; Table: Resistors SMD; Power (Watts): 0.1W, 1/10W; Part Number: R0603_51K_1%_0.1W_100PPM; Component Kind: Standard; Component Type: Standard; Pin Count: 2; Value: 51k; Status: Preferred; Case: 0603; Mounted: Yes; Socket: No; SMD: Yes; Manufacturer1 Example: NIC COMPONENT; Manufacturer1 ComponentHeight: 0.55mm; HelpURL: \\cern.ch\dfs\Applications\Altium\Datasheets\R0603_NIC_NRC.pdf; Author: CERN DEM JLC; CreateDate: 3.12.2007; LatestRevisionDate: 13.03.2008; Height: 0.022" (0.55mm); Features: Moisture Resistant; RoHS: RoHS Compliant; Number of Terminations: 2; Category: Resistors; Composition: Thick Film; Resistance (Ohms): 51k; Size / Dimension: 0.063" L x 0.031" W (1.60mm x 0.80mm); Supplier Part Number: 311-51KGRCT-ND; Supplier Device Package: 0603; Package / Case: 0603 (1608 Metric); Supplier: Digi-Key; Temperature Coefficient: ±100ppm/°C; Packaging: Cut Tape (CT); Operating Temperature: -55°C ~ 155°C
SD2-SD5 = GB042-34P-H10: Connector, eMMC
U1 = XCZU3EG-1SFVC784I: as U1 on sheet PS_GTR; Package: SFVC784; ComponentLink1Description: Datasheet; Supplier 1: Digi-Key; Supplier Part Number 1: XCZU3EG-1SFVC784I-ND; Manufacturer Part Number 1: XCZU3EG-1SFVC784I
U30 = TPM_header: GC-TPM-rev-20; Controller: Infineon SLB9665TT2.0 FW5.51; Interface: TPM header key, LPC bus PH/2*10K4/BUL/2.54; Motherboard: GIGABYTE